# Altium schematic sheet Page2.SchDoc
size A3; SheetNumber: 2
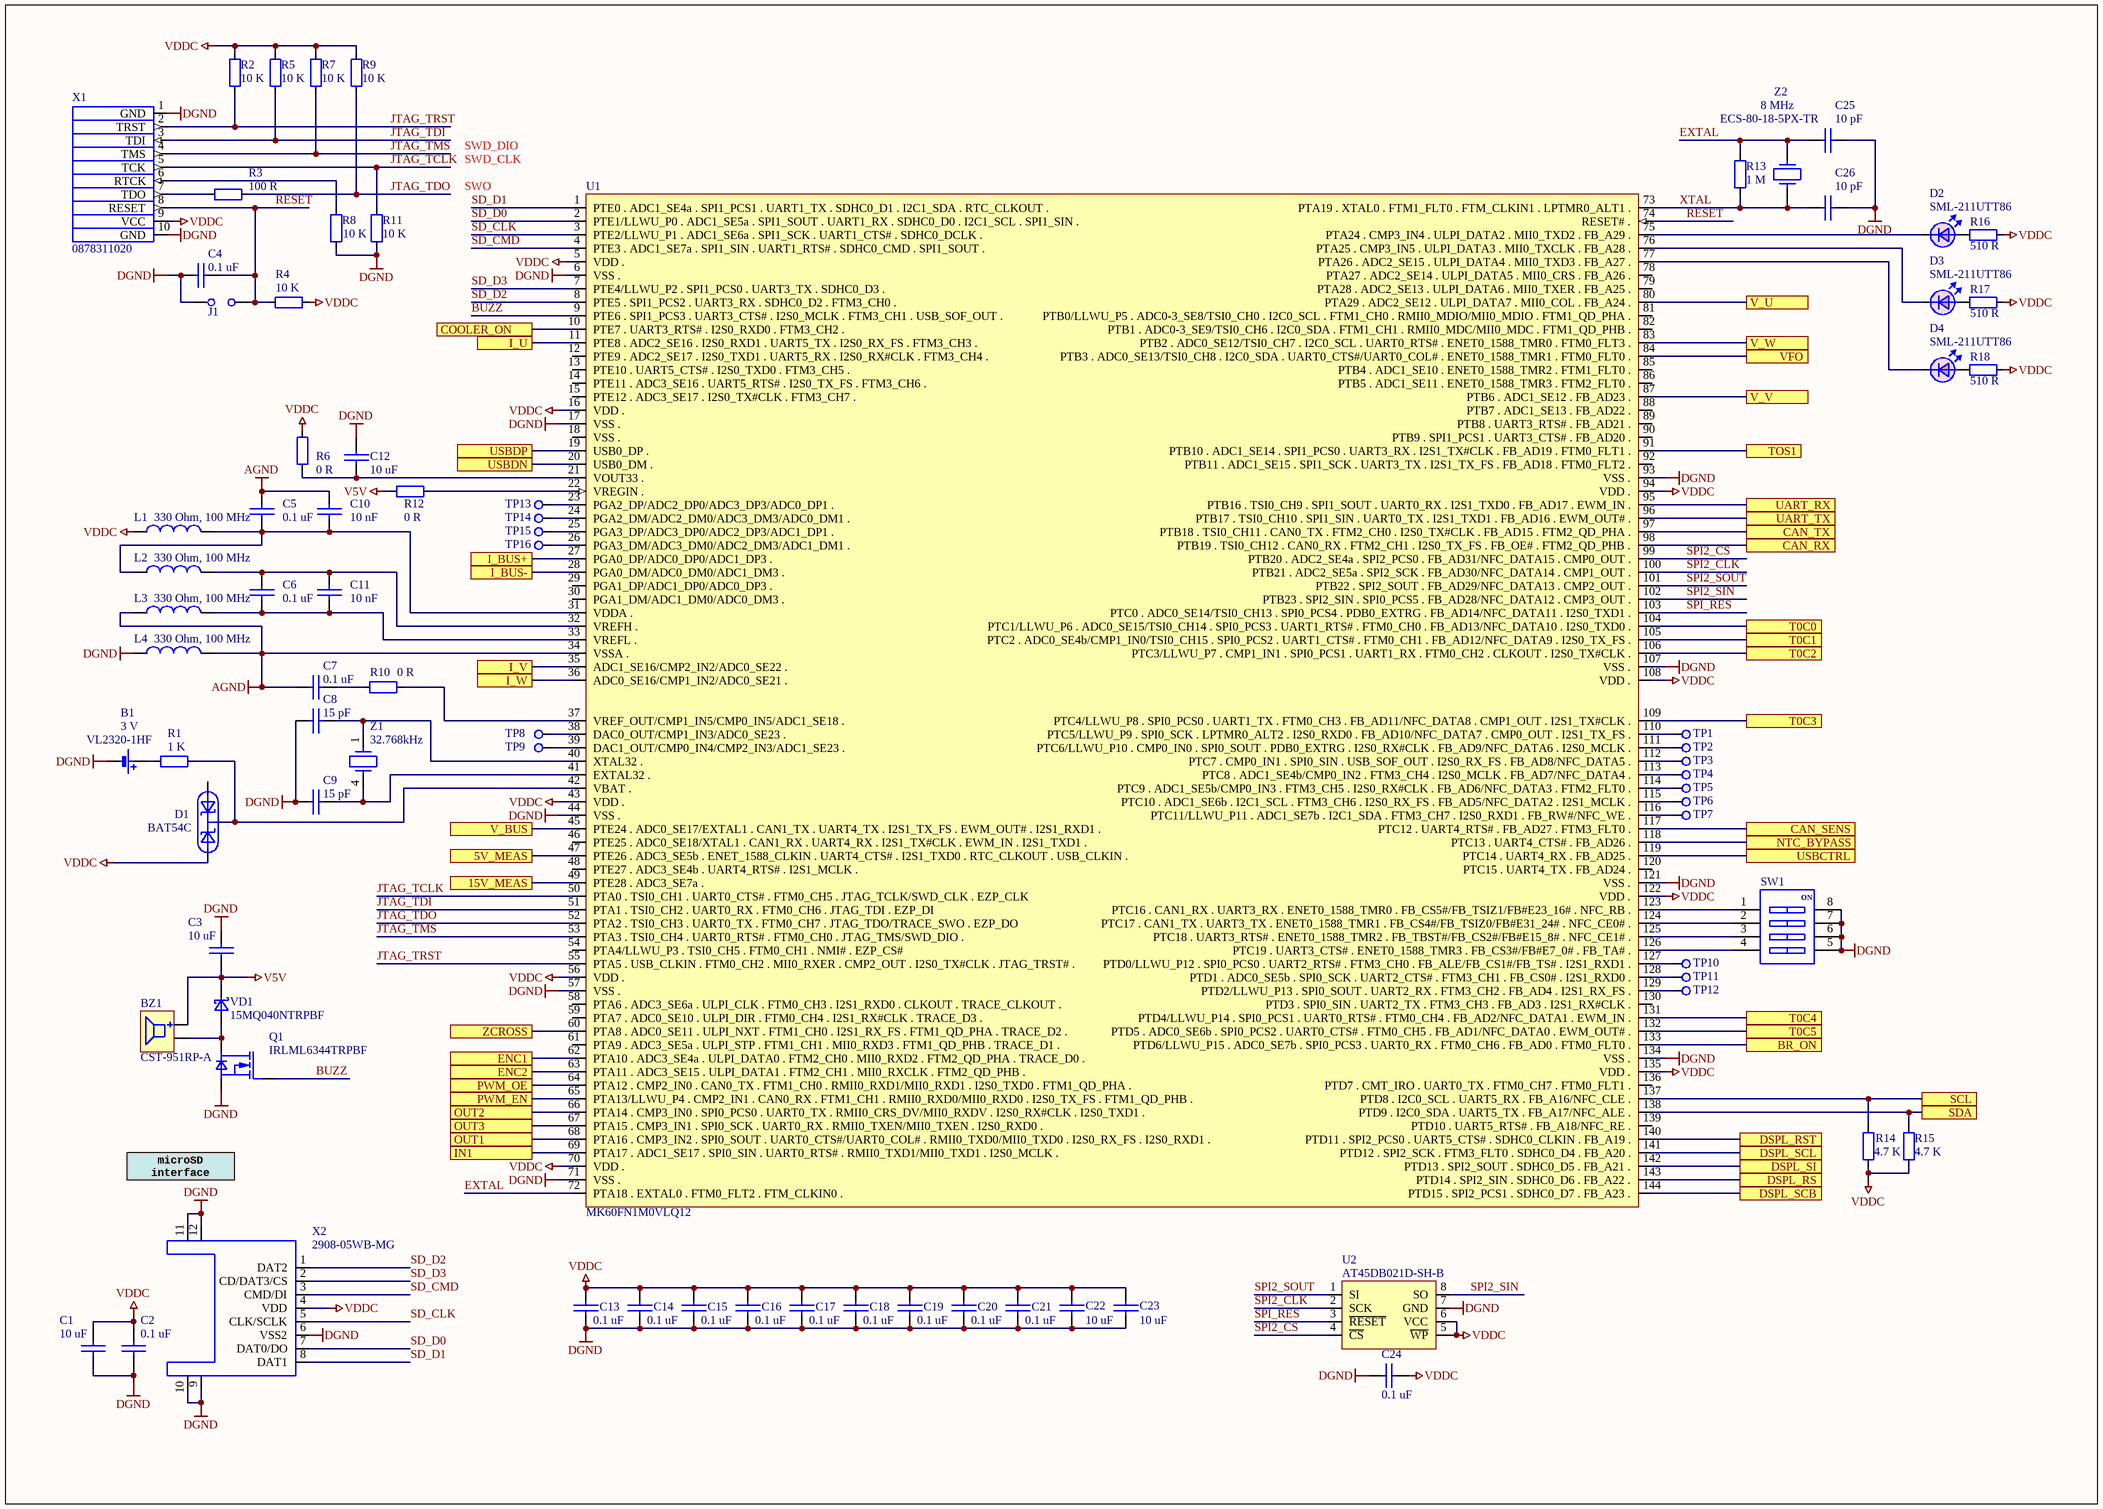
[diagram p0: Page2.SchDoc]

## Parts
B1  VL2320-1HF  value 3 V  [SANYO ML2430]
BZ1  CST-951RP-A  [CST-951RP-A]
C1  value 10 uF  [2012[0805]]  (hidden comment: C2012X5R1C106K085AC)
C2  value 0.1 uF  [1608[0603]]  (hidden comment: CL10B104KA8NNND)
C3  value 10 uF  [2012[0805]]  (hidden comment: C2012X5R1C106K085AC)
C4  value 0.1 uF  [1608[0603]]  (hidden comment: CL10B104KA8NNND)
C5  value 0.1 uF  [1608[0603]]  (hidden comment: CL10B104KA8NNND)
C6  value 0.1 uF  [1608[0603]]  (hidden comment: CL10B104KA8NNND)
C7  value 0.1 uF  [1608[0603]]  (hidden comment: CL10B104KA8NNND)
C8  value 15 pF  [1608[0603]]  (hidden comment: CC0603JRNPO9BN150)
C9  value 15 pF  [1608[0603]]  (hidden comment: CC0603JRNPO9BN150)
C10  value 10 nF  [1608[0603]]  (hidden comment: CL10B103JB8NNNC)
C11  value 10 nF  [1608[0603]]  (hidden comment: CL10B103JB8NNNC)
C12  value 10 uF  [2012[0805]]  (hidden comment: C2012X5R1C106K085AC)
C13  value 0.1 uF  [1608[0603]]  (hidden comment: CL10B104KA8NNND)
C14  value 0.1 uF  [1608[0603]]  (hidden comment: CL10B104KA8NNND)
C15  value 0.1 uF  [1608[0603]]  (hidden comment: CL10B104KA8NNND)
C16  value 0.1 uF  [1608[0603]]  (hidden comment: CL10B104KA8NNND)
C17  value 0.1 uF  [1608[0603]]  (hidden comment: CL10B104KA8NNND)
C18  value 0.1 uF  [1608[0603]]  (hidden comment: CL10B104KA8NNND)
C19  value 0.1 uF  [1608[0603]]  (hidden comment: CL10B104KA8NNND)
C20  value 0.1 uF  [1608[0603]]  (hidden comment: CL10B104KA8NNND)
C21  value 0.1 uF  [1608[0603]]  (hidden comment: CL10B104KA8NNND)
C22  value 10 uF  [2012[0805]]  (hidden comment: C2012X5R1C106K085AC)
C23  value 10 uF  [2012[0805]]  (hidden comment: C2012X5R1C106K085AC)
C24  value 0.1 uF  [1608[0603]]  (hidden comment: CL10B104KA8NNND)
C25  value 10 pF  [1608[0603]]  (hidden comment: CCPF010K0603)
C26  value 10 pF  [1608[0603]]  (hidden comment: CCPF010K0603)
D1  BAT54C  [SOT23]
D2  SML-211UTT86  [0805 LED]
D3  SML-211UTT86  [0805 LED]
D4  SML-211UTT86  [0805 LED]
J1  PH1-02-TA-HT  [HDR1X2V]  (value not drawn)
L1  value 330 Ohm, 100 MHz  [0603]  (hidden comment: BLM18SG331TN1D)
L2  value 330 Ohm, 100 MHz  [0603]  (hidden comment: BLM18SG331TN1D)
L3  value 330 Ohm, 100 MHz  [0603]  (hidden comment: BLM18SG331TN1D)
L4  value 330 Ohm, 100 MHz  [0603]  (hidden comment: BLM18SG331TN1D)
Q1  IRLML6344TRPBF  [SOT23]
R1  value 1 K  [0603]  (hidden comment: RC0603FR-071KL)
R2  value 10 K  [0603]  (hidden comment: ERJ-3EKF1002V)
R3  value 100 R  [0603]  (hidden comment: ERJ-3EKF1000V)
R4  value 10 K  [0603]  (hidden comment: ERJ-3EKF1002V)
R5  value 10 K  [0603]  (hidden comment: ERJ-3EKF1002V)
R6  value 0 R  [0603]  (hidden comment: RC0603JR-070RL)
R7  value 10 K  [0603]  (hidden comment: ERJ-3EKF1002V)
R8  value 10 K  [0603]  (hidden comment: ERJ-3EKF1002V)
R9  value 10 K  [0603]  (hidden comment: ERJ-3EKF1002V)
R10  value 0 R  [0603]  (hidden comment: RC0603JR-070RL)
R11  value 10 K  [0603]  (hidden comment: ERJ-3EKF1002V)
R12  value 0 R  [0603]  (hidden comment: RC0603JR-070RL)
R13  value 1 M  [0603]  (hidden comment: RC0603FR-071ML)
R14  value 4.7 K  [0603]  (hidden comment: RJ0603FRE074K7L)
R15  value 4.7 K  [0603]  (hidden comment: RJ0603FRE074K7L)
R16  value 510 R  [0603]  (hidden comment: CRCW0603510RFKEA)
R17  value 510 R  [0603]  (hidden comment: CRCW0603510RFKEA)
R18  value 510 R  [0603]  (hidden comment: CRCW0603510RFKEA)
SW1  MCDHN-04F-T-V  [MCDHN-04F-T-V]  (value not drawn)
TP1  TP 0.5 mm  [Test Point 0.5 mm]  (value not drawn)  (no BOM)
TP2  TP 0.5 mm  [Test Point 0.5 mm]  (value not drawn)  (no BOM)
TP3  TP 0.5 mm  [Test Point 0.5 mm]  (value not drawn)  (no BOM)
TP4  TP 0.5 mm  [Test Point 0.5 mm]  (value not drawn)  (no BOM)
TP5  TP 0.5 mm  [Test Point 0.5 mm]  (value not drawn)  (no BOM)
TP6  TP 0.5 mm  [Test Point 0.5 mm]  (value not drawn)  (no BOM)
TP7  TP 0.5 mm  [Test Point 0.5 mm]  (value not drawn)  (no BOM)
TP8  TP 0.5 mm  [Test Point 0.5 mm]  (value not drawn)  (no BOM)
TP9  TP 0.5 mm  [Test Point 0.5 mm]  (value not drawn)  (no BOM)
TP10  TP 0.5 mm  [Test Point 0.5 mm]  (value not drawn)  (no BOM)
TP11  TP 0.5 mm  [Test Point 0.5 mm]  (value not drawn)  (no BOM)
TP12  TP 0.5 mm  [Test Point 0.5 mm]  (value not drawn)  (no BOM)
TP13  TP 0.5 mm  [Test Point 0.5 mm]  (value not drawn)  (no BOM)
TP14  TP 0.5 mm  [Test Point 0.5 mm]  (value not drawn)  (no BOM)
TP15  TP 0.5 mm  [Test Point 0.5 mm]  (value not drawn)  (no BOM)
TP16  TP 0.5 mm  [Test Point 0.5 mm]  (value not drawn)  (no BOM)
U1  MK60FN1M0VLQ12  [LQFP144]
U2  AT45DB021D-SH-B  [SO-8  wide]
VD1  15MQ040NTRPBF  [SMA]
X1  0878311020  [878311020 MGRID WALL HDR]
X2  2908-05WB-MG  [2908-05WB-MG]
Z1  value 32.768kHz  [CM200S]  (hidden comment: CM200C32768DZBT)
Z2  ECS-80-18-5PX-TR  value 8 MHz  [Quartz Crystal SMU4]

## Ports
5V_MEAS, 15V_MEAS, BR_ON, CAN_RX, CAN_SENS, CAN_TX, COOLER_ON, DSPL_RS, DSPL_RST, DSPL_SCB, DSPL_SCL, DSPL_SI, ENC1, ENC2, I_BUS+, I_BUS-, I_U, I_V, I_W, IN1, NTC_BYPASS, OUT1, OUT2, OUT3, PWM_EN, PWM_OE, SCL, SDA, T0C0, T0C1, T0C2, T0C3, T0C4, T0C5, TOS1, UART_RX, UART_TX, USBCTRL, USBDN, USBDP, V_BUS, V_U, V_V, V_W, VFO, ZCROSS

## Nets
AGND: C5.2 C7.2 C10.2 L3.1 L4.2 U1.34(VSSA_.)
DGND: B1.1 C1.2 C2.2 C3.1 C4.2 C8.2 C9.2 C12.2 C13.1 C14.1 C15.1 C16.1 C17.1 C18.1 C19.1 C20.1 C21.1 C22.2 C23.2 C24.2 C25.2 C26.2 J1.2 L4.1 Q1.2(S) R8.2 R11.2 SW1.5 SW1.6 SW1.7 SW1.8 U1.6(VSS_.) U1.17(VSS_.) U1.44(VSS_.) U1.57(VSS_.) U1.71(VSS_.) U1.93(VSS_.) U1.107(VSS_.) U1.121(VSS_.) U1.134(VSS_.) U2.7(GND) X1.1(GND) X1.10(GND) X2.6(VSS2) X2.9 X2.10(WP) X2.11(GND) X2.12(GND)
V5V: BZ1.1 C3.2 R12.2 VD1.K
VDDC: C1.1 C2.1 C13.2 C14.2 C15.2 C16.2 C17.2 C18.2 C19.2 C20.2 C21.2 C22.1 C23.1 C24.1 D1.2 L1.1 R2.1 R4.1 R5.1 R6.2 R7.1 R9.1 R14.1 R15.1 R16.1 R17.1 R18.1 U1.5(VDD_.) U1.16(VDD_.) U1.43(VDD_.) U1.56(VDD_.) U1.70(VDD_.) U1.94(VDD_.) U1.108(VDD_.) U1.122(VDD_.) U1.135(VDD_.) U2.5(~{WP}) U2.6(VCC) X1.9(VCC) X2.4(VDD)
5V_MEAS: U1.47(PTE26_._ADC3_SE5b_._ENET_1588_CLKIN_._UART4_CTS#_._I2S1_TXD0_._RTC_CLKOUT_._USB_CLKIN_.) ; port 5V_MEAS
15V_MEAS: U1.49(PTE28_._ADC3_SE7a_.) ; port 15V_MEAS
BR_ON: U1.133(PTD6/LLWU_P15_._ADC0_SE7b_._SPI0_PCS3_._UART0_RX_._FTM0_CH6_._FB_AD0_._FTM0_FLT0_.) ; port BR_ON
BUZZ: Q1.1(G) U1.9(PTE6_._SPI1_PCS3_._UART3_CTS#_._I2S0_MCLK_._FTM3_CH1_._USB_SOF_OUT_.)
CAN_RX: U1.98(PTB19_._TSI0_CH12_._CAN0_RX_._FTM2_CH1_._I2S0_TX_FS_._FB_OE#_._FTM2_QD_PHB_.) ; port CAN_RX
CAN_SENS: U1.117(PTC12_._UART4_RTS#_._FB_AD27_._FTM3_FLT0_.) ; port CAN_SENS
CAN_TX: U1.97(PTB18_._TSI0_CH11_._CAN0_TX_._FTM2_CH0_._I2S0_TX#CLK_._FB_AD15_._FTM2_QD_PHA_.) ; port CAN_TX
COOLER_ON: U1.10(PTE7_._UART3_RTS#_._I2S0_RXD0_._FTM3_CH2_.) ; port COOLER_ON
DSPL_RS: U1.143(PTD14_._SPI2_SIN_._SDHC0_D6_._FB_A22_.) ; port DSPL_RS
DSPL_RST: U1.140(PTD11_._SPI2_PCS0_._UART5_CTS#_._SDHC0_CLKIN_._FB_A19_.) ; port DSPL_RST
DSPL_SCB: U1.144(PTD15_._SPI2_PCS1_._SDHC0_D7_._FB_A23_.) ; port DSPL_SCB
DSPL_SCL: U1.141(PTD12_._SPI2_SCK_._FTM3_FLT0_._SDHC0_D4_._FB_A20_.) ; port DSPL_SCL
DSPL_SI: U1.142(PTD13_._SPI2_SOUT_._SDHC0_D5_._FB_A21_.) ; port DSPL_SI
ENC1: U1.62(PTA10_._ADC3_SE4a_._ULPI_DATA0_._FTM2_CH0_._MII0_RXD2_._FTM2_QD_PHA_._TRACE_D0_.) ; port ENC1
ENC2: U1.63(PTA11_._ADC3_SE15_._ULPI_DATA1_._FTM2_CH1_._MII0_RXCLK_._FTM2_QD_PHB_.) ; port ENC2
EXTAL: C25.1 R13.2 U1.72(PTA18_._EXTAL0_._FTM0_FLT2_._FTM_CLKIN0_.) Z2.2
I_BUS+: U1.27(PGA0_DP/ADC0_DP0/ADC1_DP3_.) ; port I_BUS+
I_BUS-: U1.28(PGA0_DM/ADC0_DM0/ADC1_DM3_.) ; port I_BUS-
I_U: U1.11(PTE8_._ADC2_SE16_._I2S0_RXD1_._UART5_TX_._I2S0_RX_FS_._FTM3_CH3_.) ; port I_U
I_V: U1.35(ADC1_SE16/CMP2_IN2/ADC0_SE22_.) ; port I_V
I_W: U1.36(ADC0_SE16/CMP1_IN2/ADC0_SE21_.) ; port I_W
IN1: U1.69(PTA17_._ADC1_SE17_._SPI0_SIN_._UART0_RTS#_._RMII0_TXD1/MII0_TXD1_._I2S0_MCLK_.) ; port IN1
JTAG_TCLK: R11.1 U1.50(PTA0_._TSI0_CH1_._UART0_CTS#_._FTM0_CH5_._JTAG_TCLK/SWD_CLK_._EZP_CLK) X1.5(TCK)
JTAG_TDI: R5.2 U1.51(PTA1_._TSI0_CH2_._UART0_RX_._FTM0_CH6_._JTAG_TDI_._EZP_DI) X1.3(TDI)
JTAG_TDO: R3.1 R9.2 U1.52(PTA2_._TSI0_CH3_._UART0_TX_._FTM0_CH7_._JTAG_TDO/TRACE_SWO_._EZP_DO)
JTAG_TMS: R7.2 U1.53(PTA3_._TSI0_CH4_._UART0_RTS#_._FTM0_CH0_._JTAG_TMS/SWD_DIO_.) X1.4(TMS)
JTAG_TRST: R2.2 U1.55(PTA5_._USB_CLKIN_._FTM0_CH2_._MII0_RXER_._CMP2_OUT_._I2S0_TX#CLK_._JTAG_TRST#_.) X1.2(TRST)
NTC_BYPASS: U1.118(PTC13_._UART4_CTS#_._FB_AD26_.) ; port NTC_BYPASS
OUT1: U1.68(PTA16_._CMP3_IN2_._SPI0_SOUT_._UART0_CTS#/UART0_COL#_._RMII0_TXD0/MII0_TXD0_._I2S0_RX_FS_._I2S0_RXD1_.) ; port OUT1
OUT2: U1.66(PTA14_._CMP3_IN0_._SPI0_PCS0_._UART0_TX_._RMII0_CRS_DV/MII0_RXDV_._I2S0_RX#CLK_._I2S0_TXD1_.) ; port OUT2
OUT3: U1.67(PTA15_._CMP3_IN1_._SPI0_SCK_._UART0_RX_._RMII0_TXEN/MII0_TXEN_._I2S0_RXD0_.) ; port OUT3
PWM_EN: U1.65(PTA13/LLWU_P4_._CMP2_IN1_._CAN0_RX_._FTM1_CH1_._RMII0_RXD0/MII0_RXD0_._I2S0_TX_FS_._FTM1_QD_PHB_.) ; port PWM_EN
PWM_OE: U1.64(PTA12_._CMP2_IN0_._CAN0_TX_._FTM1_CH0_._RMII0_RXD1/MII0_RXD1_._I2S0_TXD0_._FTM1_QD_PHA_.) ; port PWM_OE
RESET: C4.1 J1.1 R4.2 U1.74(RESET#_.) X1.8(RESET)
SCL: R14.2 U1.137(PTD8_._I2C0_SCL_._UART5_RX_._FB_A16/NFC_CLE_.) ; port SCL
SD_CLK: U1.3(PTE2/LLWU_P1_._ADC1_SE6a_._SPI1_SCK_._UART1_CTS#_._SDHC0_DCLK_.) X2.5(CLK/SCLK)
SD_CMD: U1.4(PTE3_._ADC1_SE7a_._SPI1_SIN_._UART1_RTS#_._SDHC0_CMD_._SPI1_SOUT_.) X2.3(CMD/DI)
SD_D0: U1.2(PTE1/LLWU_P0_._ADC1_SE5a_._SPI1_SOUT_._UART1_RX_._SDHC0_D0_._I2C1_SCL_._SPI1_SIN_.) X2.7(DAT0/DO)
SD_D1: U1.1(PTE0_._ADC1_SE4a_._SPI1_PCS1_._UART1_TX_._SDHC0_D1_._I2C1_SDA_._RTC_CLKOUT_.) X2.8(DAT1)
SD_D2: U1.8(PTE5_._SPI1_PCS2_._UART3_RX_._SDHC0_D2_._FTM3_CH0_.) X2.1(DAT2)
SD_D3: U1.7(PTE4/LLWU_P2_._SPI1_PCS0_._UART3_TX_._SDHC0_D3_.) X2.2(CD/DAT3/CS)
SDA: R15.2 U1.138(PTD9_._I2C0_SDA_._UART5_TX_._FB_A17/NFC_ALE_.) ; port SDA
SPI2_CLK: U1.100(PTB21_._ADC2_SE5a_._SPI2_SCK_._FB_AD30/NFC_DATA14_._CMP1_OUT_.) U2.2(SCK)
SPI2_CS: U1.99(PTB20_._ADC2_SE4a_._SPI2_PCS0_._FB_AD31/NFC_DATA15_._CMP0_OUT_.) U2.4(~{CS})
SPI2_SIN: U1.102(PTB23_._SPI2_SIN_._SPI0_PCS5_._FB_AD28/NFC_DATA12_._CMP3_OUT_.) U2.8(SO)
SPI2_SOUT: U1.101(PTB22_._SPI2_SOUT_._FB_AD29/NFC_DATA13_._CMP2_OUT_.) U2.1(SI)
SPI_RES: U1.103(PTC0_._ADC0_SE14/TSI0_CH13_._SPI0_PCS4_._PDB0_EXTRG_._FB_AD14/NFC_DATA11_._I2S0_TXD1_.) U2.3(~{RESET})
T0C0: U1.104(PTC1/LLWU_P6_._ADC0_SE15/TSI0_CH14_._SPI0_PCS3_._UART1_RTS#_._FTM0_CH0_._FB_AD13/NFC_DATA10_._I2S0_TXD0_.) ; port T0C0
T0C1: U1.105(PTC2_._ADC0_SE4b/CMP1_IN0/TSI0_CH15_._SPI0_PCS2_._UART1_CTS#_._FTM0_CH1_._FB_AD12/NFC_DATA9_._I2S0_TX_FS_.) ; port T0C1
T0C2: U1.106(PTC3/LLWU_P7_._CMP1_IN1_._SPI0_PCS1_._UART1_RX_._FTM0_CH2_._CLKOUT_._I2S0_TX#CLK_.) ; port T0C2
T0C3: U1.109(PTC4/LLWU_P8_._SPI0_PCS0_._UART1_TX_._FTM0_CH3_._FB_AD11/NFC_DATA8_._CMP1_OUT_._I2S1_TX#CLK_.) ; port T0C3
T0C4: U1.131(PTD4/LLWU_P14_._SPI0_PCS1_._UART0_RTS#_._FTM0_CH4_._FB_AD2/NFC_DATA1_._EWM_IN_.) ; port T0C4
T0C5: U1.132(PTD5_._ADC0_SE6b_._SPI0_PCS2_._UART0_CTS#_._FTM0_CH5_._FB_AD1/NFC_DATA0_._EWM_OUT#_.) ; port T0C5
TOS1: U1.91(PTB10_._ADC1_SE14_._SPI1_PCS0_._UART3_RX_._I2S1_TX#CLK_._FB_AD19_._FTM0_FLT1_.) ; port TOS1
UART_RX: U1.95(PTB16_._TSI0_CH9_._SPI1_SOUT_._UART0_RX_._I2S1_TXD0_._FB_AD17_._EWM_IN_.) ; port UART_RX
UART_TX: U1.96(PTB17_._TSI0_CH10_._SPI1_SIN_._UART0_TX_._I2S1_TXD1_._FB_AD16_._EWM_OUT#_.) ; port UART_TX
USBCTRL: U1.119(PTC14_._UART4_RX_._FB_AD25_.) ; port USBCTRL
USBDN: U1.20(USB0_DM_.) ; port USBDN
USBDP: U1.19(USB0_DP_.) ; port USBDP
V_BUS: U1.45(PTE24_._ADC0_SE17/EXTAL1_._CAN1_TX_._UART4_TX_._I2S1_TX_FS_._EWM_OUT#_._I2S1_RXD1_.) ; port V_BUS
V_U: U1.80(PTA29_._ADC2_SE12_._ULPI_DATA7_._MII0_COL_._FB_A24_.) ; port V_U
V_V: U1.87(PTB6_._ADC1_SE12_._FB_AD23_.) ; port V_V
V_W: U1.83(PTB2_._ADC0_SE12/TSI0_CH7_._I2C0_SCL_._UART0_RTS#_._ENET0_1588_TMR0_._FTM0_FLT3_.) ; port V_W
VFO: U1.84(PTB3_._ADC0_SE13/TSI0_CH8_._I2C0_SDA_._UART0_CTS#/UART0_COL#_._ENET0_1588_TMR1_._FTM0_FLT0_.) ; port VFO
XTAL: C26.1 R13.1 U1.73(PTA19_._XTAL0_._FTM1_FLT0_._FTM_CLKIN1_._LPTMR0_ALT1_.) Z2.1
ZCROSS: U1.60(PTA8_._ADC0_SE11_._ULPI_NXT_._FTM1_CH0_._I2S1_RX_FS_._FTM1_QD_PHA_._TRACE_D2_.) ; port ZCROSS
NetB1_2: B1.2 R1.2
NetBZ1_2: BZ1.2 Q1.3(D) VD1.A
NetC5_1: C5.1 C10.1 L1.2 L2.1 U1.31(VDDA_.)
NetC6_1: C6.1 C11.1 L3.2 U1.33(VREFL_.)
NetC6_2: C6.2 C11.2 L2.2 U1.32(VREFH_.)
NetC7_1: C7.1 R10.1
NetC8_1: C8.1 U1.40(XTAL32_.) Z1.1
NetC9_1: C9.1 U1.41(EXTAL32_.) Z1.4
NetC12_1: C12.1 R6.1 U1.21(VOUT33_.)
NetD1_3: D1.3 R1.1 U1.42(VBAT_.)
NetD2_1: D2.1 R16.2
NetD2_2: D2.2 U1.75(PTA24_._CMP3_IN4_._ULPI_DATA2_._MII0_TXD2_._FB_A29_.)
NetD3_1: D3.1 R17.2
NetD3_2: D3.2 U1.76(PTA25_._CMP3_IN5_._ULPI_DATA3_._MII0_TXCLK_._FB_A28_.)
NetD4_1: D4.1 R18.2
NetD4_2: D4.2 U1.77(PTA26_._ADC2_SE15_._ULPI_DATA4_._MII0_TXD3_._FB_A27_.)
NetR3_2: R3.2 X1.7(TDO)
NetR8_1: R8.1 X1.6(RTCK)
NetR10_2: R10.2 U1.37(VREF_OUT/CMP1_IN5/CMP0_IN5/ADC1_SE18_.)
NetR12_1: R12.1 U1.22(VREGIN_.)
NetSW1_1: SW1.1 U1.123(PTC16_._CAN1_RX_._UART3_RX_._ENET0_1588_TMR0_._FB_CS5#/FB_TSIZ1/FB#E23_16#_._NFC_RB_.)
NetSW1_2: SW1.2 U1.124(PTC17_._CAN1_TX_._UART3_TX_._ENET0_1588_TMR1_._FB_CS4#/FB_TSIZ0/FB#E31_24#_._NFC_CE0#_.)
NetSW1_3: SW1.3 U1.125(PTC18_._UART3_RTS#_._ENET0_1588_TMR2_._FB_TBST#/FB_CS2#/FB#E15_8#_._NFC_CE1#_.)
NetSW1_4: SW1.4 U1.126(PTC19_._UART3_CTS#_._ENET0_1588_TMR3_._FB_CS3#/FB#E7_0#_._FB_TA#_.)
NetTP1_1: TP1.1 U1.110(PTC5/LLWU_P9_._SPI0_SCK_._LPTMR0_ALT2_._I2S0_RXD0_._FB_AD10/NFC_DATA7_._CMP0_OUT_._I2S1_TX_FS_.)
NetTP2_1: TP2.1 U1.111(PTC6/LLWU_P10_._CMP0_IN0_._SPI0_SOUT_._PDB0_EXTRG_._I2S0_RX#CLK_._FB_AD9/NFC_DATA6_._I2S0_MCLK_.)
NetTP3_1: TP3.1 U1.112(PTC7_._CMP0_IN1_._SPI0_SIN_._USB_SOF_OUT_._I2S0_RX_FS_._FB_AD8/NFC_DATA5_.)
NetTP4_1: TP4.1 U1.113(PTC8_._ADC1_SE4b/CMP0_IN2_._FTM3_CH4_._I2S0_MCLK_._FB_AD7/NFC_DATA4_.)
NetTP5_1: TP5.1 U1.114(PTC9_._ADC1_SE5b/CMP0_IN3_._FTM3_CH5_._I2S0_RX#CLK_._FB_AD6/NFC_DATA3_._FTM2_FLT0_.)
NetTP6_1: TP6.1 U1.115(PTC10_._ADC1_SE6b_._I2C1_SCL_._FTM3_CH6_._I2S0_RX_FS_._FB_AD5/NFC_DATA2_._I2S1_MCLK_.)
NetTP7_1: TP7.1 U1.116(PTC11/LLWU_P11_._ADC1_SE7b_._I2C1_SDA_._FTM3_CH7_._I2S0_RXD1_._FB_RW#/NFC_WE_.)
NetTP8_1: TP8.1 U1.38(DAC0_OUT/CMP1_IN3/ADC0_SE23_.)
NetTP9_1: TP9.1 U1.39(DAC1_OUT/CMP0_IN4/CMP2_IN3/ADC1_SE23_.)
NetTP10_1: TP10.1 U1.127(PTD0/LLWU_P12_._SPI0_PCS0_._UART2_RTS#_._FTM3_CH0_._FB_ALE/FB_CS1#/FB_TS#_._I2S1_RXD1_.)
NetTP11_1: TP11.1 U1.128(PTD1_._ADC0_SE5b_._SPI0_SCK_._UART2_CTS#_._FTM3_CH1_._FB_CS0#_._I2S1_RXD0_.)
NetTP12_1: TP12.1 U1.129(PTD2/LLWU_P13_._SPI0_SOUT_._UART2_RX_._FTM3_CH2_._FB_AD4_._I2S1_RX_FS_.)
NetTP13_1: TP13.1 U1.23(PGA2_DP/ADC2_DP0/ADC3_DP3/ADC0_DP1_.)
NetTP14_1: TP14.1 U1.24(PGA2_DM/ADC2_DM0/ADC3_DM3/ADC0_DM1_.)
NetTP15_1: TP15.1 U1.25(PGA3_DP/ADC3_DP0/ADC2_DP3/ADC1_DP1_.)
NetTP16_1: TP16.1 U1.26(PGA3_DM/ADC3_DM0/ADC2_DM3/ADC1_DM1_.)

Not connected (* = marked no-connect by the designer): D1 1; U1 12(PTE9_._ADC2_SE17_._I2S0_TXD1_._UART5_RX_._I2S0_RX#CLK_._FTM3_CH4_.) 13(PTE10_._UART5_CTS#_._I2S0_TXD0_._FTM3_CH5_.) 14(PTE11_._ADC3_SE16_._UART5_RTS#_._I2S0_TX_FS_._FTM3_CH6_.) 15(PTE12_._ADC3_SE17_._I2S0_TX#CLK_._FTM3_CH7_.) 18(VSS_.) 29(PGA1_DP/ADC1_DP0/ADC0_DP3_.) 30(PGA1_DM/ADC1_DM0/ADC0_DM3_.) 46(PTE25_._ADC0_SE18/XTAL1_._CAN1_RX_._UART4_RX_._I2S1_TX#CLK_._EWM_IN_._I2S1_TXD1_.) 48(PTE27_._ADC3_SE4b_._UART4_RTS#_._I2S1_MCLK_.) 54(PTA4/LLWU_P3_._TSI0_CH5_._FTM0_CH1_._NMI#_._EZP_CS#) 58(PTA6_._ADC3_SE6a_._ULPI_CLK_._FTM0_CH3_._I2S1_RXD0_._CLKOUT_._TRACE_CLKOUT_.) 59(PTA7_._ADC0_SE10_._ULPI_DIR_._FTM0_CH4_._I2S1_RX#CLK_._TRACE_D3_.) 61(PTA9_._ADC3_SE5a_._ULPI_STP_._FTM1_CH1_._MII0_RXD3_._FTM1_QD_PHB_._TRACE_D1_.) 78(PTA27_._ADC2_SE14_._ULPI_DATA5_._MII0_CRS_._FB_A26_.) 79(PTA28_._ADC2_SE13_._ULPI_DATA6_._MII0_TXER_._FB_A25_.) 81(PTB0/LLWU_P5_._ADC0-3_SE8/TSI0_CH0_._I2C0_SCL_._FTM1_CH0_._RMII0_MDIO/MII0_MDIO_._FTM1_QD_PHA_.) 82(PTB1_._ADC0-3_SE9/TSI0_CH6_._I2C0_SDA_._FTM1_CH1_._RMII0_MDC/MII0_MDC_._FTM1_QD_PHB_.) 85(PTB4_._ADC1_SE10_._ENET0_1588_TMR2_._FTM1_FLT0_.) 86(PTB5_._ADC1_SE11_._ENET0_1588_TMR3_._FTM2_FLT0_.) 88(PTB7_._ADC1_SE13_._FB_AD22_.) 89(PTB8_._UART3_RTS#_._FB_AD21_.) 90(PTB9_._SPI1_PCS1_._UART3_CTS#_._FB_AD20_.) 92(PTB11_._ADC1_SE15_._SPI1_SCK_._UART3_TX_._I2S1_TX_FS_._FB_AD18_._FTM0_FLT2_.) 120(PTC15_._UART4_TX_._FB_AD24_.) 130(PTD3_._SPI0_SIN_._UART2_TX_._FTM3_CH3_._FB_AD3_._I2S1_RX#CLK_.) 136(PTD7_._CMT_IRO_._UART0_TX_._FTM0_CH7_._FTM0_FLT1_.) 139(PTD10_._UART5_RTS#_._FB_A18/NFC_RE_.)

## Notes on the sheet
- SWD_CLK
- SWD_DIO
- SWO
- microSD
  interface
- (in symbol MCDHN-04F-T-V) ON

## Library data of the parts
B1 = VL2320-1HF: Rechargeable Litium battery, Sanyo, 100 mAh, 3.1 V; PartNum: P083-ND; Manufacturer: Panasonic - BSG; Price: 5.85$; Distributor: Digi-Key; PartName: VL2320-1HF; Price50: 4.68$; Price100: 4.1$; Price1000: 3.51$
BZ1 = CST-951RP-A: Buzzer CST-951AP, 4,5...5,5 V,  85 dB,   80 mA; Manufacturer: CUI Inc; PartNum: 102-1462-ND; Distributor: DigiKey; Price: 1.29$; PartName: 102-1462-ND
C1 C3 C12 C22 C23 = C2012X5R1C106K/0.85: 10 uF, 16V, X5R, ±10%, 0805; Manufacturer: TDK Corporation; Distributor: Future; Price: 0.0347 Euro; Tolerance: ±10%; PartNum: C2012X5R1C106K085AC; Voltage: 16V; PartName: C2012X5R1C106K085AC; Price50: 0.0347 Euro; Price100: 0.0347 Euro; Price1000: 0.0347 Euro
C2 C4-C7 C13-C21 C24 = CVNF100K0603-25: 0.1 uF, 25V, 10% , X7R,  0603 SMD MLC Capacitor; Manufacturer: SAMSUNG; Tolerance: 10%; Distributor: Future; Price: 0.0026 Euro; Voltage: 25 V; PartNum: CL10B104KA8NNND; PartName: CL10B104KA8NNND; Price50: 0.0026 Euro; Price100: 0.0026 Euro; Price1000: 0.0026 Euro
C8 C9 = CCPF015K0603: 15 pF, 50V, 5%, NP0, 0603 SMD MLC Capacitor; Manufacturer: YAGEO AMERICA CORPORATION; Tolerance: 5%; Price: 0.003$; Distributor: Future; PartNum: CC0603JRNPO9BN150; Voltage: 50 V; PartName: CC0603JRNPO9BN150; Price50: 0.003$; Price100: 0.003$; Price1000: 0.003$
C10 C11 = CVNF010K0603: 10 nF, 50V, 5%, X7R, 0603 SMD MLC Capacitor; Manufacturer: SAMSUNG; Tolerance: 5%; Distributor: Future; Price: 0.0045 Euro; PartNum: CL10B103JB8NNNC; Voltage: 50 V; PartName: CL10B103JB8NNNC; Price50: 0.0045 Euro; Price100: 0.0045 Euro; Price1000: 0.0045 Euro
C25 C26 = CCPF010K0603: 10 pF, 50V, 5%, NP0, 0603 SMD MLC Capacitor; Manufacturer: Kemet; PartNum: 399-1049-1-ND; PartName: C0603C100J5GACTU; Tolerance: 5%; Price: 0.0075$; Distributor: Digi-Key; Voltage: 50 V
D1 = BAT54C: Schottky Diode, 30 V, 200 mA, common cathode; Manufacturer: Fairchild Semiconductor; PartNum: BAT54CFSCT-ND; Distributor: Digi-Key; Price: 0.2$; PartName: BAT54C; Price50: 0.16$; Price100: 0.13$; Price1000: 0.05$
D2-D4 = SML-211UTT86: 0805 red LED, hibright, 2 mA, 1.8V, 130°; Manufacturer: Rohm; PartNum: 511-1292-1-ND; Ordered: Digi-Key; Distributor: Digi-Key; Price: 0.57$; Value: Red; PartName: SML-211UTT86; Price50: 0.39$; Price100: 0.34$; Price1000: 0.2$
J1 = Jumper: 2 Pos. 2.54 mm Single Row Through Hole Straight Pin Header; Manufacturer: ADAM TECH; Distributor: Future; Price: 0.02 Euro; PartNum: PH1-02-TA-HT; PartName: PH1-02-TA-HT; Price50: 0.02 Euro; Price100: 0.02 Euro; Price1000: 0.02 Euro
L1-L4 = BLM18SG331TN1D: Ferrite bead, 330 Ohm, 100 MHz,  1.5 A, 0.07 Ohm; Manufacturer: Murata Electronics North America; Tolerance: 25%; Distributor: Future; Price: 0.03 Euro; PartNum: BLM18SG331TN1D; PartName: BLM18SG331TN1D; Price50: 0.03 Euro; Price100: 0.03 Euro; Price1000: 0.03 Euro
Q1 = IRLML6344TRPBF: N-channel MOSFET, 30V, 5A, 0.030 Ohm 3.3 V, SOT-23; Manufacturer: International Rectifier; PartNum: IRLML6344TRPBFCT-ND; Price: 0.23$; Distributor: DigiKey; PartName: IRLML6344TRPBF
R1 = RL0603K001-1: 1 K, 1%, 0603, SMD Resistor, Taped; Manufacturer: YAGEO AMERICA CORPORATION; Voltage: 75 V; Distributor: Future; Price: 0.0017$; Tolerance: 1%; PartNum: RC0603FR-071KL; PartName: RC0603FR-071KL; Price50: 0.0017$; Price100: 0.0017$; Price1000: 0.0017$
R2 R4 R5 R7-R9 R11 = RL0603K010-1: 10 K, 1%, 0603, SMD Resistor, Taped; Manufacturer: PANASONIC; Voltage: 75 V; Distributor: Future; Price: 0.0015 Euro; Tolerance: 1%; PartNum: ERJ-3EKF1002V; PartName: ERJ-3EKF1002V; Price50: 0.0015 Euro; Price100: 0.0015 Euro; Price1000: 0.0015 Euro
R3 = RL0603E100-1: 100 R, 1%, 0603, SMD Resistor, Taped; Manufacturer: PANASONIC; Voltage: 75 V; Distributor: Future; Price: 0.0017$; Tolerance: 1%; PartNum: ERJ-3EKF1000V; PartName: ERJ-3EKF1000V; Price50: 0.0015 Euro; Price100: 0.0015 Euro; Price1000: 0.0015 Euro
R6 R10 R12 = RL0603E000: 0 R, 5%, 0603, SMD Resistor, Taped; Manufacturer: YAGEO AMERICA CORPORATION; Voltage: 75 V; Distributor: Future; Price: 0.0017$; Tolerance: 5%; PartNum: RC0603JR-070RL; PartName: RC0603JR-070RL; Price50: 0.0017$; Price100: 0.0017$; Price1000: 0.0017$
R13 = RC0603FR-071ML: 1 M, 1%, 0603, SMD Resistor, Taped; Manufacturer: YAGEO AMERICA CORPORATION; Voltage: 75 V; Distributor: Future; Price: 0.002 Euro; Tolerance: 1%; PartNum: RC0603FR-071ML; PartName: RC0603FR-071ML
R14 R15 = RL0603K004.7-1_1: 4.7 K, 1%, 0603, SMD Resistor, Taped; Manufacturer: YAGEO AMERICA CORPORATION; Voltage: 75 V; Distributor: Future; Price: 0.0017$; Tolerance: 1%; PartNum: RJ0603FRE074K7L; PartName: RJ0603FRE074K7L; Price50: 0.0017$; Price100: 0.0017$; Price1000: 0.0017$
R16-R18 = RL0603E510-1: 510 R, 1%, 0603, SMD Resistor, Taped; Manufacturer: Vishay; Voltage: 75 V; Distributor: Future; Price: 0.002 Euro; Tolerance: 1%; PartNum: CRCW0603510RFKEA; PartName: CRCW0603510RFKEA
SW1 = MCDHN-04F-T-V: SWITCH, DIP, SMD, 4 WAY, 1.27mm; Manufacturer: MULTICOMP; PartNum: 1605479; Distributor: Farnell; Price: 0.69 Euro
U1 = MK60FN1M0VLQ12: MK60 Series 32 Bit 1 MB Flash 128 KB Ram 120 Mhz Microcontroller - LQFP-144; Manufacturer: Freescale; Distributor: Future; PartNum: MK60FN1M0VLQ12; Price: 8.45 Euro
U2 = AT45DB011D-SH-T: IC DATAFLASH 1MBIT 2.7 V ~ 3.6 V 8-SOIC; Manufacturer: Adesto Technologies; PartNum: 1265-1033-1-ND; Price: 0.8$; Distributor: Digi-Key; PartName: AT45DB021D-SH-B
VD1 = 15MQ040N: Schottky Power Rectifier 3A, 40V, SMA; Manufacturer: VISHAY; Ordered: Future; Price: 0.13 Euro; Distributor: Digi-Key; PartNum: 15MQ040NTRPBF; PartName: 15MQ040NTRPBF; Price50: 0.11 Euro; Price100: 0.11 Euro; Price1000: 0.1 Euro
X1 = 87831-1020: CONN HEADER 10POS 2MM VERT GOLD; Manufacturer: Molex Inc; PartNum: WM18560-ND; Distributor: Digi-Key; Price: 0.81$; PartName: 0878311020; Price50: 0.81$; Price100: 0.81$; Price1000: 0.39$
X2 = 2908-05WB-MG: microSD cadr holder; Manufacturer: Amphenol Commercial Products; PartNum: 101-00660-68-6-1-ND; PartName: 101-00660-68-6; Ordered: Digi-Key; Price: 1.97$; Distributor: Digi-Key; Price50: 1.44$; Price100: 1.29$; Price1000: 1.06$
Z1 = MC306-32,768: Crystal 32.768 kHz ±20 ppm 6 pF -40 to +85 °C SMT Tuning Fork Crystal; Manufacturer: CITIZEN FINETECH MIYOTA; Tolerance: 20 ppm; PartNum: CM200C32768DZBT; Price: 0.1956 Euro; Distributor: Future; PartName: CM200C32768DZBT; Price50: 0.1956  Euro; Price100: 0.1956  Euro; Price1000: 0.1956  Euro
Z2 = ECS-80-18-5PX-TR: 8 MHz, CSM-7 Case Series, SMD, Low Profile, Load Capacitance 18pF  ,Operating Temperature -10°C ~ 70°C; Manufacturer: ECS Inc.; PartNum: XC1271CT-ND; Distributor: Digi-Key; Price: 0.61$; PartName: ECS-80-18-5PX-TR